# EAGLE design Light Curtain 5 (EAGLE 9.4.2)
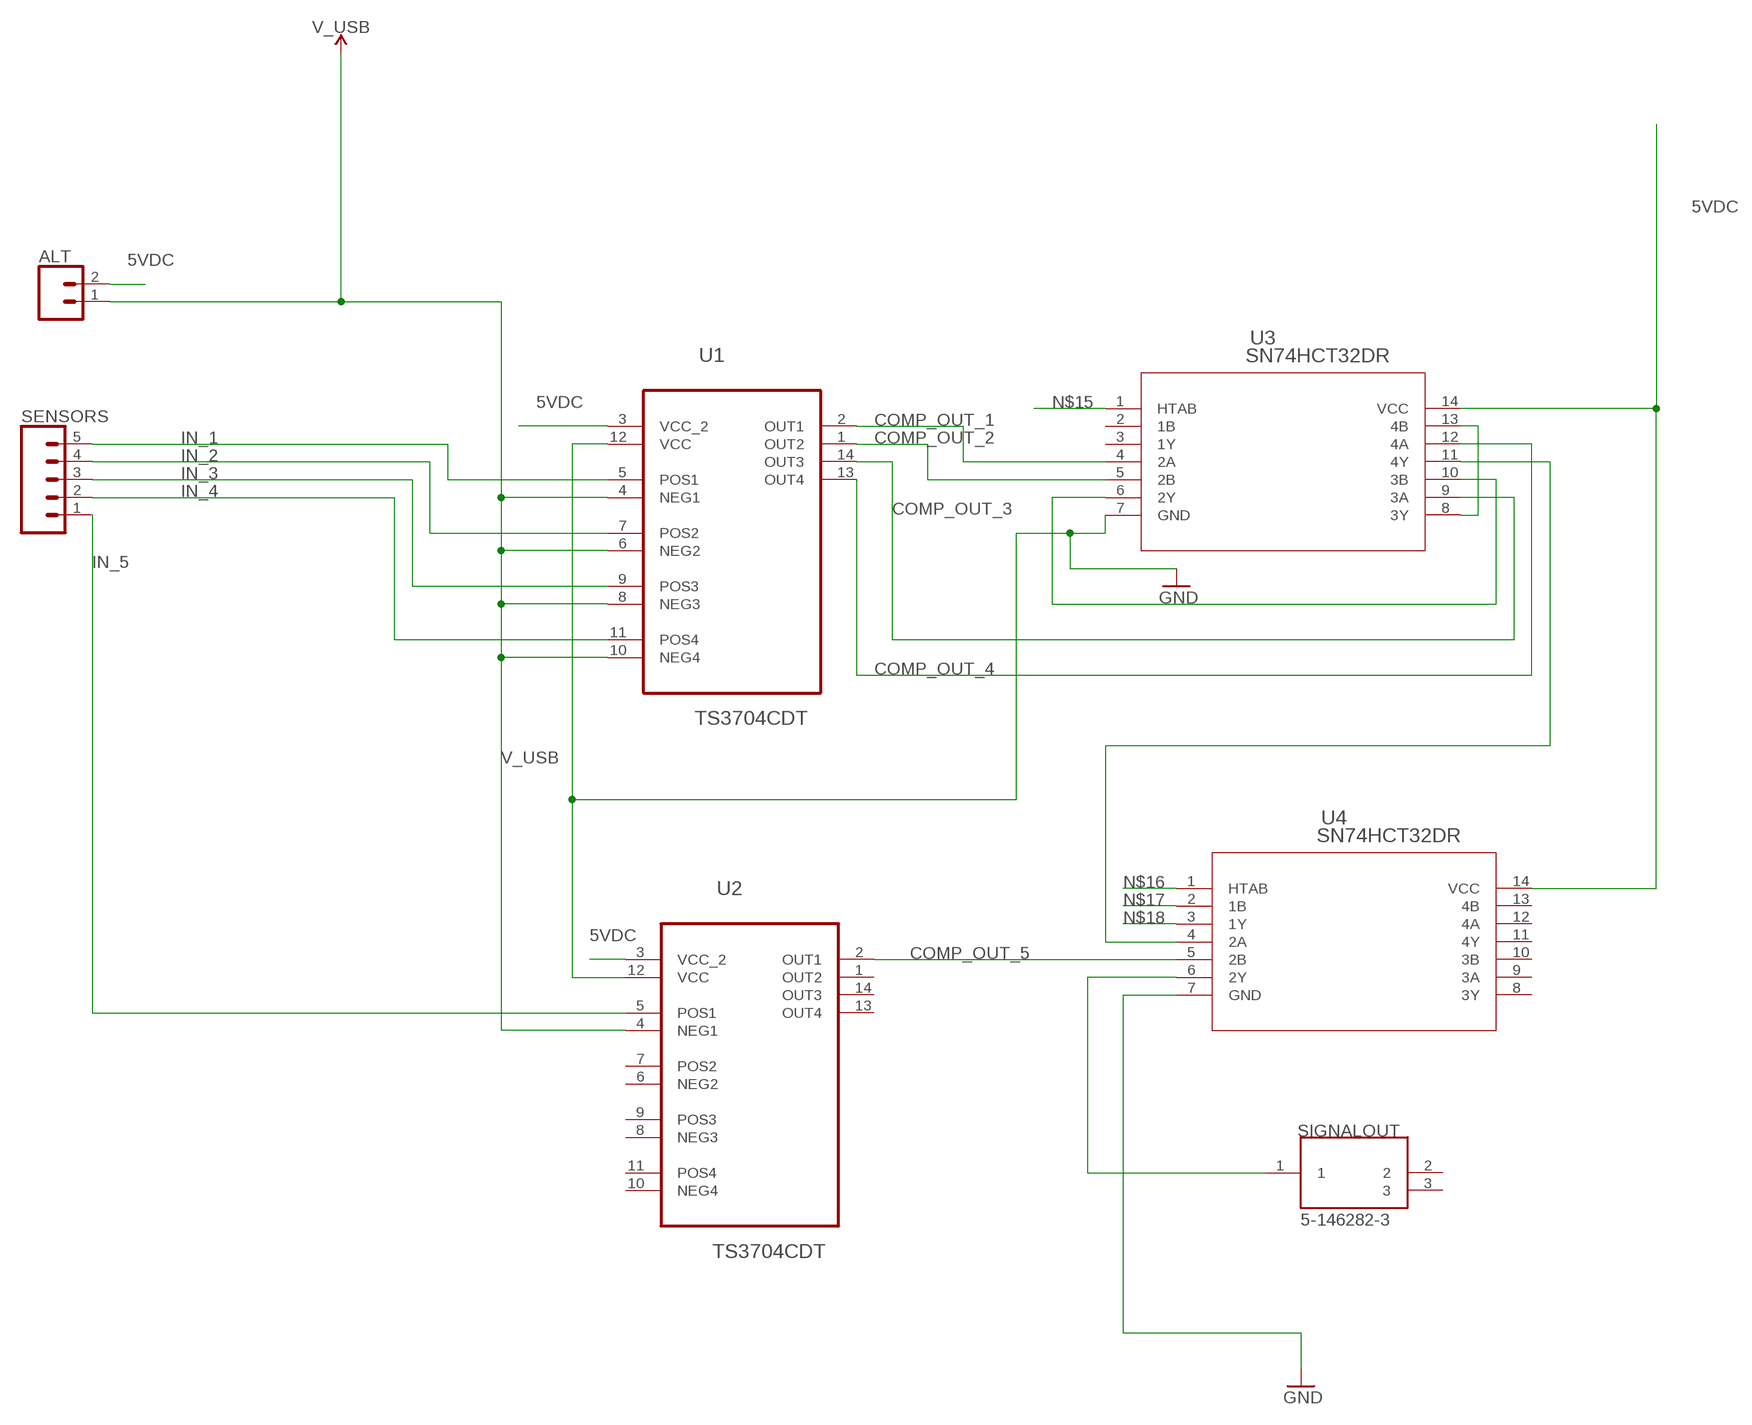
[diagram p0: schematic, sheet 1]

## Parts
ALT  CONN_02  [1X02]
SENSORS  CONN_05  [1X05]
SIGNALOUT  5-146282-3  [TE_5-146282-3]
U1  TS3704CDT  [SOIC127P600X175-14N]
U2  TS3704CDT  [SOIC127P600X175-14N]
U3  SN74HCT32DR  [D14]
U4  SN74HCT32DR  [D14]

## Nets
5VDC: ALT.2 U1.3(VCC_2) U2.3(VCC_2) U3.14(VCC) U4.14(VCC)
COMP_OUT_1: U1.2(OUT1) U3.4(2A)
COMP_OUT_2: U1.1(OUT2) U3.5(2B)
COMP_OUT_3: U1.14(OUT3) U3.9(3A)
COMP_OUT_4: U1.13(OUT4) U3.12(4A)
COMP_OUT_5: U2.2(OUT1) U4.5(2B)
GND: U1.12(VCC) U2.12(VCC) U3.7(GND) U4.7(GND)
IN_1: SENSORS.5 U1.5(POS1)
IN_2: SENSORS.4 U1.7(POS2)
IN_3: SENSORS.3 U1.9(POS3)
IN_4: SENSORS.2 U1.11(POS4)
IN_5: SENSORS.1 U2.5(POS1)
N$9: U3.6(2Y) U3.10(3B)
N$11: U3.8(3Y) U3.13(4B)
N$12: U3.11(4Y) U4.4(2A)
N$14: SIGNALOUT.1 U4.6(2Y)
N$15: U3.1(HTAB)
N$16: U4.1(HTAB)
N$17: U4.2(1B)
N$18: U4.3(1Y)
V_USB: ALT.1 U1.4(NEG1) U1.6(NEG2) U1.8(NEG3) U1.10(NEG4) U2.4(NEG1)
Unconnected: SIGNALOUT.2 SIGNALOUT.3 U2.1(OUT2) U2.6(NEG2) U2.7(POS2) U2.8(NEG3) U2.9(POS3) U2.10(NEG4) U2.11(POS4) U2.13(OUT4) U2.14(OUT3) U3.2(1B) U3.3(1Y) U4.8(3Y) U4.9(3A) U4.10(3B) U4.11(4Y) U4.12(4A) U4.13(4B)

## Library data of the parts
ALT = SparkFun-Connectors:CONN_02: Multi connection point. Often used as Generic Header-pin footprint for 0.1 inch spaced/style header connections On any of the 0.1 inch spaced packages, you can populate with these: Break Away Headers - Straight <https://www.sparkfun.com/products/116> (PRT-00116) Break Away Male Headers - Right Angle <https://www.sparkfun.com/products/553> (PRT-00553) Female Headers <https://www.sparkfun.com/products/115> (PRT-00115) Break Away Headers - Machine Pin <https://www.sparkfun.com/products/117> (PRT-00117) Break Away Female Headers - Swiss Machine Pin <https://www.sparkfun.com/products/743> (PRT-00743) For SCREWTERMINALS and SPRING TERMINALS visit here: Screw Terimnals on SparkFun.com <https://www.sparkfun.com/search/results?term=Screw+Terminals> (5mm/3.5mm/2.54mm spacing) This device is also useful as a general connection point to wire up your design to another part of your project. Our various solder wires solder well into these plated through hole pads. Hook-Up Wire - Assortment (Stranded, 22 AWG) <https://www.sparkfun.com/products/11375> (PRT-11375) Hook-Up Wire - Assortment (Solid Core, 22 AWG) <https://www.sparkfun.com/products/11367> (PRT-11367) View the entire wire category on our website here <https://www.sparkfun.com/categories/141> Special notes: Molex polarized connector foot print use with: PRT-08233 with associated crimp pins and housings. 2.54_SCREWTERM for use with PRT-10571. 3.5mm Screw Terminal footprints for PRT-08084 5mm Screw Terminal footprints for use with PRT-08432
SENSORS = SparkFun-Connectors:CONN_05: Multi connection point. Often used as Generic Header-pin footprint for 0.1 inch spaced/style header connections On any of the 0.1 inch spaced packages, you can populate with these: Break Away Headers - Straight <https://www.sparkfun.com/products/116> (PRT-00116) Break Away Male Headers - Right Angle <https://www.sparkfun.com/products/553> (PRT-00553) Female Headers <https://www.sparkfun.com/products/115> (PRT-00115) Break Away Headers - Machine Pin <https://www.sparkfun.com/products/117> (PRT-00117) Break Away Female Headers - Swiss Machine Pin <https://www.sparkfun.com/products/743> (PRT-00743) For SCREWTERMINALS and SPRING TERMINALS visit here: Screw Terimnals on SparkFun.com <https://www.sparkfun.com/search/results?term=Screw+Terminals> (5mm/3.5mm/2.54mm spacing) This device is also useful as a general connection point to wire up your design to another part of your project. Our various solder wires solder well into these plated through hole pads. Hook-Up Wire - Assortment (Stranded, 22 AWG) <https://www.sparkfun.com/products/11375> (PRT-11375) Hook-Up Wire - Assortment (Solid Core, 22 AWG) <https://www.sparkfun.com/products/11367> (PRT-11367) View the entire wire category on our website here <https://www.sparkfun.com/categories/141> Special notes: Molex polarized connector foot print use with SKU : PRT-08231 with associated crimp pins and housings. 1MM SMD Version SKU: PRT-10208
SIGNALOUT = 5-146282-3:5-146282-3: 03 MODII HDR SRST B/A .100CL; AVAILABILITY: Unavailable; CENTERLINE_PITCH: 2.54 mm[.1 in]; COMMENT: 5-146282-3; DESCRIPTION: 03 MODII HDR SRST B/A .100CL; EU_ROHS_COMPLIANCE: Compliant; MF: TE Connectivity; MP: 5-146282-3; NUMBER_OF_POSITIONS: 3; PACKAGE: None; PRICE: None; PRODUCT_TYPE: Connector; TE_PURCHASE_URL: https://www.te.com/usa-en/product-5-146282-3.html?te_bu=Cor&te_type=disp&te_campaign=seda_glo_cor-seda-global-disp-prtnr-fy19-seda-model-bom-cta_sma-317_1&elqCampaignId=32493
U1 U2 = 1-Comparator-TS3704CDT:TS3704CDT: Micropower quad CMOS voltage comparators; AVAILABILITY: Unavailable; DESCRIPTION: Micropower quad CMOS voltage comparator; MF: STMicroelectronics; MP: TS3704CD; PACKAGE: SO-14 STMicroelectronics; PRICE: None
U3 U4 = 1-ti-or:SN74HCT32DR; MANUFACTURER_PART_NUMBER: SN74HCT32DR; VENDOR: Vendor

## Net classes
0 default: width 0.254 mm, drill 0.254 mm, clearance 0.305 mm

## Board
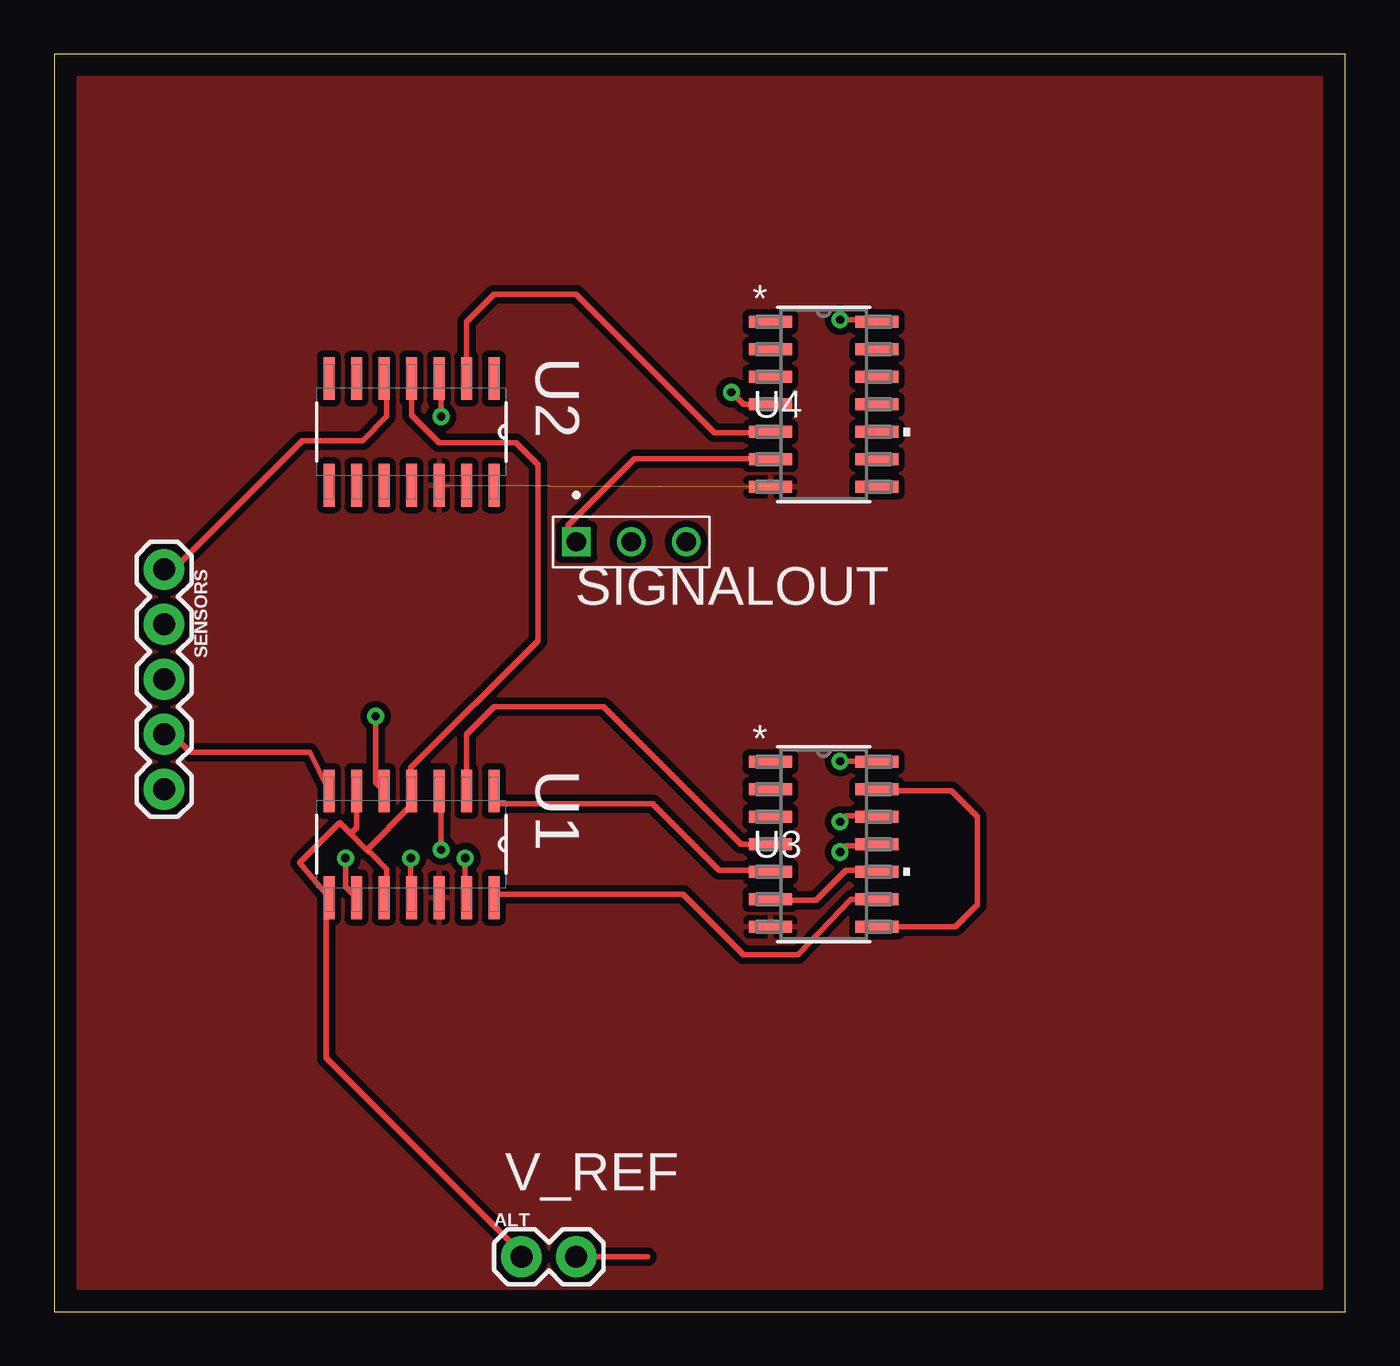
[diagram p1: board, top side]
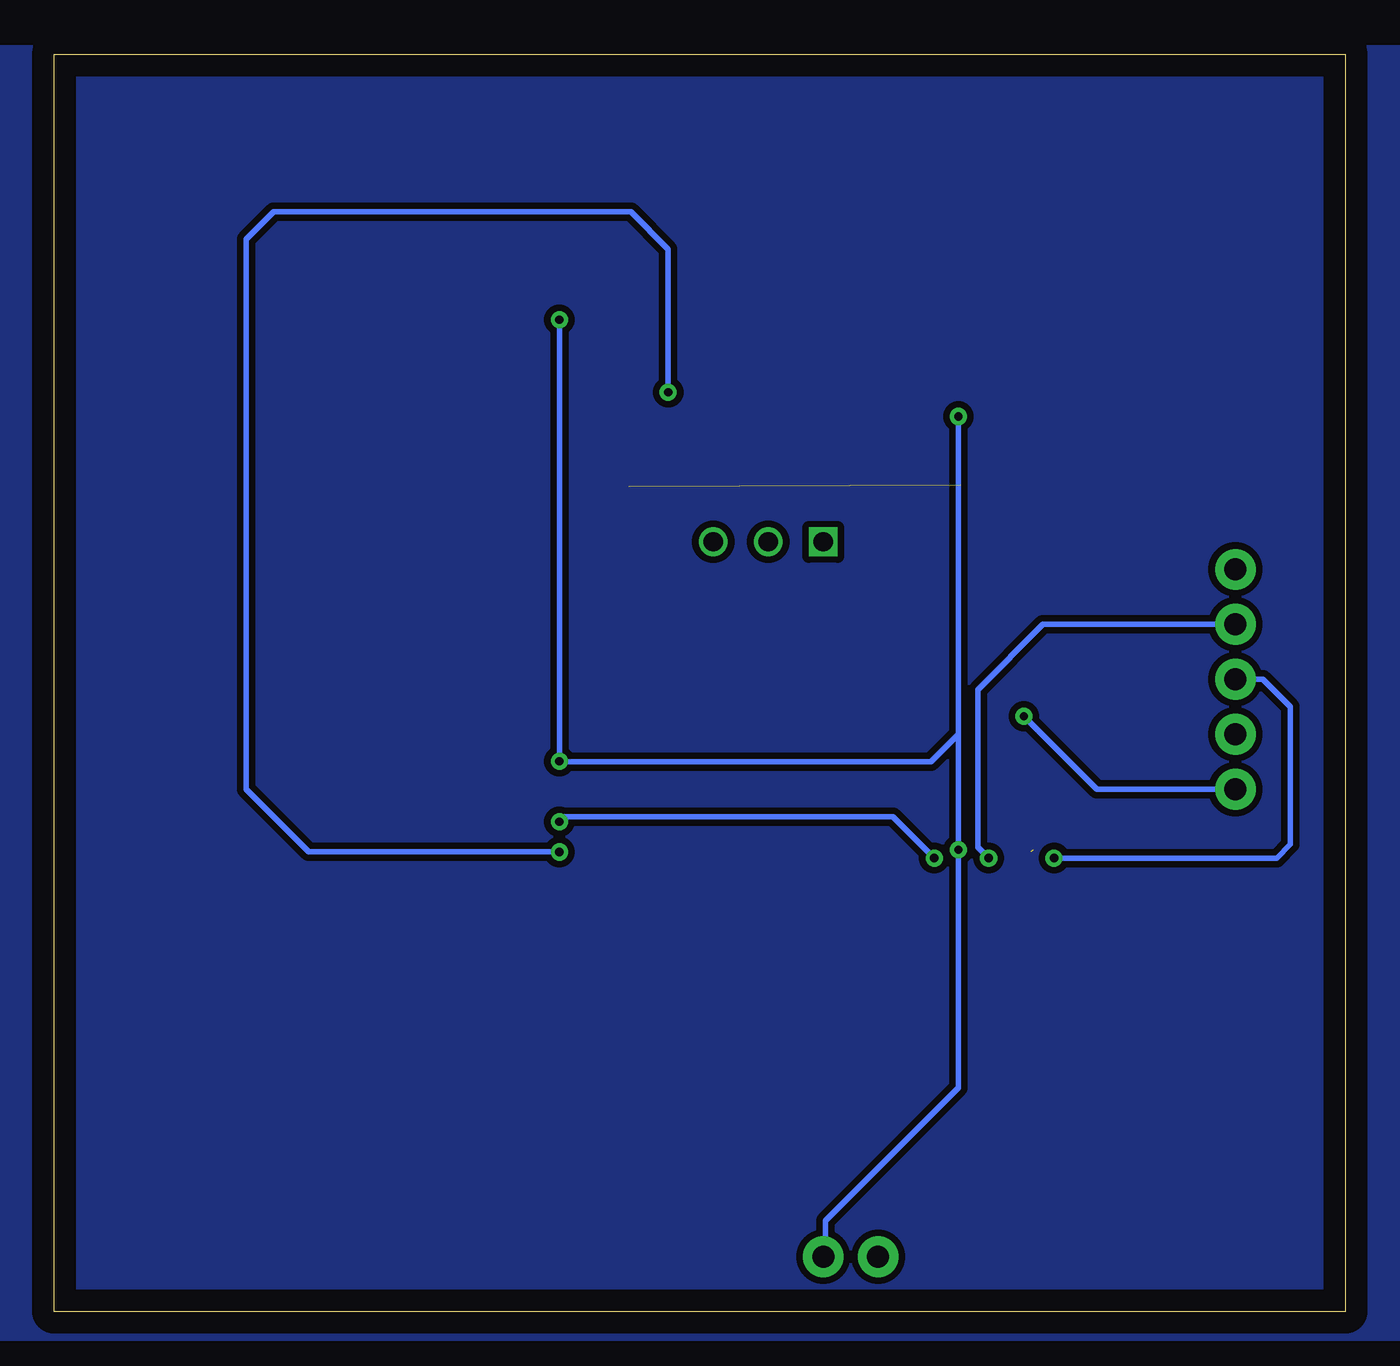
[diagram p2: board, bottom side, seen from below]

Size 59.67 x 58.09 mm. Coordinates in mm from the lower left corner, seen from the top.
Outline: 0,0 59.67,0 59.67,58.09 0,58.09 0,0
Copper layers (1*16): Top 0.035mm / dielectric 1.5mm / Bottom 0.035mm
Design rules "Standard *": minimum track width 10mil, minimum drill 15mil, track to track 12mil, track to pad 12mil, pad to pad 12mil, via to via 12mil, smd to smd 12mil, copper to edge 40mil, drill to drill 10mil, minimum pad ring 8mil, minimum via ring 8mil, stop-mask expansion 4mil, vias tented up to drill 0mil, thermal gap 10mil

### Footprints (pad centres in the part's own frame; a part is rotated, then mirrored left to right if it is on the bottom)
1X02 = drill 1.016 pad 1.88: 1 0,0; 2 2.54,0
1X05 = drill 1.016 pad 1.88: 1 0,0; 2 2.54,0; 3 5.08,0; 4 7.62,0; 5 10.16,0
TE_5-146282-3 = drill 0.89 square: 1 -2.54,0 | drill 0.89: 2 0,0; 3 2.54,0
SOIC127P600X175-14N = smd 1.981 x 0.508: 1 -2.464,3.81; 2 -2.464,2.54; 3 -2.464,1.27; 4 -2.464,0; 5 -2.464,-1.27; 6 -2.464,-2.54; 7 -2.464,-3.81; 8 2.464,-3.81; 9 2.464,-2.54; 10 2.464,-1.27; 11 2.464,0; 12 2.464,1.27; 13 2.464,2.54; 14 2.464,3.81
D14 = smd 1.981 x 0.559: 1 -2.464,3.81; 2 -2.464,2.54; 3 -2.464,1.27; 4 -2.464,0; 5 -2.464,-1.27; 6 -2.464,-2.54; 7 -2.464,-3.81; 8 2.464,-3.81; 9 2.464,-2.54; 10 2.464,-1.27; 11 2.464,0; 12 2.464,1.27; 13 2.464,2.54; 14 2.464,3.81

### Placement (x,y rotation side)
ALT  21.59,2.54 0 top
SENSORS  5.08,34.29 270 top
SIGNALOUT  26.67,35.56 0 top
U1  16.51,21.59 270 top
U2  16.51,40.64 270 top
U3  35.56,21.59 0 top
U4  35.56,41.91 0 top

### Tracks (layer width: path | path; a pad name or v marks a point on that pad's centre or on a via)
5VDC  (via drill 0.38)
  Top 0.254: v17.88,21.34 17.88,24.03 U1.3 | v17.88,41.35 17.88,43.03 U2.3 | v36.32,25.43 38,25.43 U3.14 | v36.32,45.82 38,45.82 U4.14 | ALT.2 27.43,2.54
  Bottom 0.254: ALT.2 24.03,2.79 24.03,4.19 17.88,10.34 v17.88,21.34 17.88,26.67 | 17.88,26.67 v17.88,41.35 | v36.32,45.82 v36.32,25.43 36.3,25.4 19.15,25.4 17.88,26.67
COMP_OUT_1
  Top 0.254: U1.2 19.05,26.67 20.32,27.94 25.4,27.94 31.75,21.59 U3.4
COMP_OUT_2
  Top 0.254: U1.1 20.4,24.03 20.4,23.47 27.66,23.47 30.73,20.4 32.97,20.4 U3.5
COMP_OUT_3
  Top 0.254: U1.14 20.4,19.28 29.06,19.28 31.85,16.48 34.37,16.48 36.83,19.05 U3.9
COMP_OUT_4  (via drill 0.38)
  Top 0.254: v19,20.95 19,19.28 U1.13 | v36.32,22.63 36.6,22.91 38,22.91 U3.12
  Bottom 0.254: v19,20.95 20.9,22.86 36.09,22.86 v36.32,22.63
COMP_OUT_5
  Top 0.254: U4.5 33.06,40.6 30.52,40.6 24.13,46.99 20.32,46.99 19.05,45.72 U2.2
GND  (1 unrouted)
  pour Top: -2.54,58.42 63.5,58.42 63.5,-1.27 -1.27,-1.27 -2.54,0
  pour Bottom: -2.54,58.42 63.5,58.42 63.5,-1.27 60.96,-1.27 -2.54,-1.27 -2.54,0
IN_1  (via drill 0.38)
  Top 0.254: U1.5 14.86,24.43 v14.86,27.51
  Bottom 0.254: v14.86,27.51 11.48,24.13 SENSORS.5
IN_2
  Top 0.254: U1.7 11.81,25.83 6.3,25.83 5.31,26.82 SENSORS.4
IN_3  (via drill 0.38)
  Top 0.254: v13.46,20.95 13.46,19.63 U1.9
  Bottom 0.254: v13.46,20.95 3.17,20.95 2.54,21.59 2.54,27.94 3.81,29.21 SENSORS.3
IN_4  (via drill 0.38)
  Top 0.254: v16.48,20.95 16.48,19.28 U1.11
  Bottom 0.254: SENSORS.2 13.97,31.75 16.99,28.73 16.99,21.46 v16.48,20.95
IN_5
  Top 0.254: U2.5 15.37,43.03 15.37,41.35 14.25,40.23 11.46,40.23 5.31,34.09 SENSORS.1
N$9
  Top 0.254: U3.6 33.25,19 35.2,19 36.6,20.4 38,20.4 U3.10
N$11
  Top 0.254: 38.28,17.88 U3.8 41.66,17.78 42.67,18.8 42.67,22.86 41.46,24.07 38.18,24.07 | 38.28,24.03 38.18,24.07 | 38.18,24.07 U3.13
N$12  (via drill 0.38)
  Top 0.254: v36.32,21.23 36.6,21.51 38,21.51 U3.11 | v31.29,42.47 31.85,41.91 U4.4
  Bottom 0.254: v31.29,42.47 31.29,49.07 33.02,50.8 49.53,50.8 50.8,49.53 50.8,24.13 47.9,21.23 v36.32,21.23
N$14
  Top 0.254: U4.6 32.97,39.4 26.82,39.4 23.75,36.32 23.75,36.04 24.03,35.76 SIGNALOUT.1
V_USB  (1 unrouted)
  Top 0.254: 13.69,22.07 13.97,22.35 U1.6 | 13.69,22.07 14.44,21.32 16.48,23.37 16.48,24.03 | 13.69,22.07 13.18,22.58 11.35,20.75 U1.8 12.57,19 12.57,11.73 21.51,2.79 ALT.1 | U1.10 15.37,19.28 15.37,20.45 14.58,21.23 14.53,21.23 | 16.48,24.03 U1.4 | 16.48,24.03 16.48,25.12 22.35,30.99 22.35,39.12 21.34,40.13 17.78,40.13 16.51,41.4 U2.4

### Text on the board
tNames: V_REF